# Altium schematic sheet Charging_Cap_1p25kV.SchDoc
size A; SheetNumber: 4; SheetTotal: 4
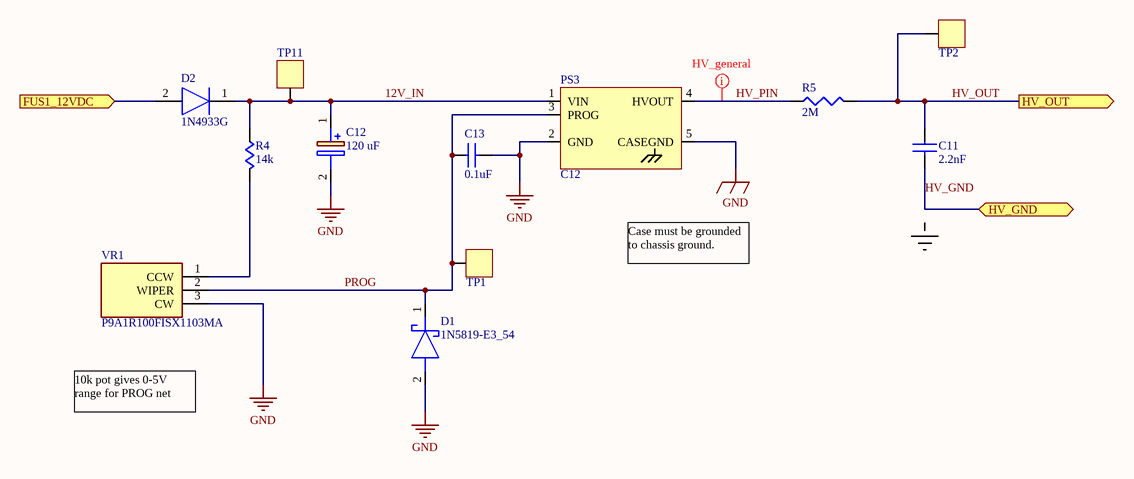
[diagram p0: Charging_Cap_1p25kV.SchDoc]

## Parts
C11  2.2nF  [C331C222KHR5HA]
C12  120 uF  [CAPPRD500W65D1000H1400]
C13  0.1uF  [C420C104K5R5TA7200]
D1  1N5819-E3_54  [DIOAD1405W86L465D235]
D2  1N4933G  [DIOAD1405W86L465D235]
PS3  C12  [C12]
R4  14k  [MFR-25FBF52-14K]
R5  2M  [HHV1WSJT-73-2M]
TP1  5261  [5261]  (value not drawn)
TP2  5261  [5261]  (value not drawn)
TP11  5261  [5261]  (value not drawn)
VR1  P9A1R100FISX1103MA  [P9A1R100FISX1103MA]

## Ports
FUS1_12VDC (in), HV_GND (bidir), HV_OUT (out)

## Nets
GND: C12.2(-) C13.2 D1.2(A) PS3.2(GND) PS3.5(CASEGND) VR1.3(CW)
12V_IN: C12.1(+) D2.1(K) PS3.1(VIN) R4.1 TP11.1
FUS1_12VDC: D2.2(A) ; port FUS1_12VDC
HV_GND: C11.2 ; port HV_GND
HV_OUT: C11.1 R5.2 TP2.1 ; port HV_OUT
HV_PIN: PS3.4(HVOUT) R5.1
PROG: C13.1 D1.1(K) PS3.3(PROG) TP1.1 VR1.2(WIPER)
NetR4_2: R4.2 VR1.1(CCW)

## Layout directives
net class HV_general: HV_PIN

## Notes on the sheet
- Case must be grounded to chassis ground.
- 10k pot gives 0-5V range for PROG net

## Library data of the parts
C11 = C331C222KHR5HA: Multilayer Ceramic Capacitors MLCC - Leaded 3000V 2200pF X7R 10% LS=6.35mm
C12 = EEU-TP1V121: Capacitor Polarised; Manufacturer_Name: Panasonic; Datasheet Link: http://industrial.panasonic.com/cdbs/www-data/pdf/RDF0000/ABA0000C1134.pdf; Height: 14mm; Manufacturer_Part_Number: EEU-TP1V121
C13 = C420C104K5R5TA7200: CAP CER TH 0.1UF 50V X7R AXIAL
D1 = 1N5819-E3_54: Schottky Diode; Manufacturer_Name: Vishay; Manufacturer_Part_Number: 1N5819-E3/54; Datasheet Link: https://www.vishay.com/docs/88525/1n5817.pdf; Mouser Part Number: 625-1N5819-E3; Mouser Price/Stock: https://www.mouser.co.uk/ProductDetail/Vishay-General-Semiconductor/1N5819-E3-54?qs=7w0fSgRKp93guDuu%252B5hJ0Q%3D%3D
D2 = 1N4933G: Rectifiers 50V 1A Fast; Manufacturer_Name: ON Semiconductor; Datasheet Link: https://www.arrow.com/en/products/1n4933g/on-semiconductor; Manufacturer_Part_Number: 1N4933G; Mouser Part Number: 863-1N4933G; Mouser Price/Stock: https://www.mouser.co.uk/ProductDetail/onsemi/1N4933G?qs=y2kkmE52mdNCdpmhcWNRQA%3D%3D; Arrow Part Number: 1N4933G; Arrow Price/Stock: https://www.arrow.com/en/products/1n4933g/on-semiconductor?region=nac
PS3 = C12: MPN is C12, DC DC conv
R4 = MFR-25FBF52-14K: RES TH 14K OHM 1% 1/4W AXIAL
R5 = HHV1WSJT-73-2M: RES 2M OHM 5% 1W AXIAL
TP1 TP2 TP11 = 5261: TEST POINT grabber (BLACK) - MINIATURE
VR1 = P9A1R100FISX1103MA: Variable Resistor 10K; Manufacturer_Name: Vishay; Datasheet Link: https://www.mouser.com/datasheet/2/427/p9-1763422.pdf; Height: 11.35mm; Manufacturer_Part_Number: P9A1R100FISX1103MA; Mouser Part Number: 72-P9A1RFISX1BB2103M; Mouser Price/Stock: https://www.mouser.com/Search/Refine.aspx?Keyword=72-P9A1RFISX1BB2103M